# Altium schematic sheet 10.SchDoc
size 246 x 182 mm
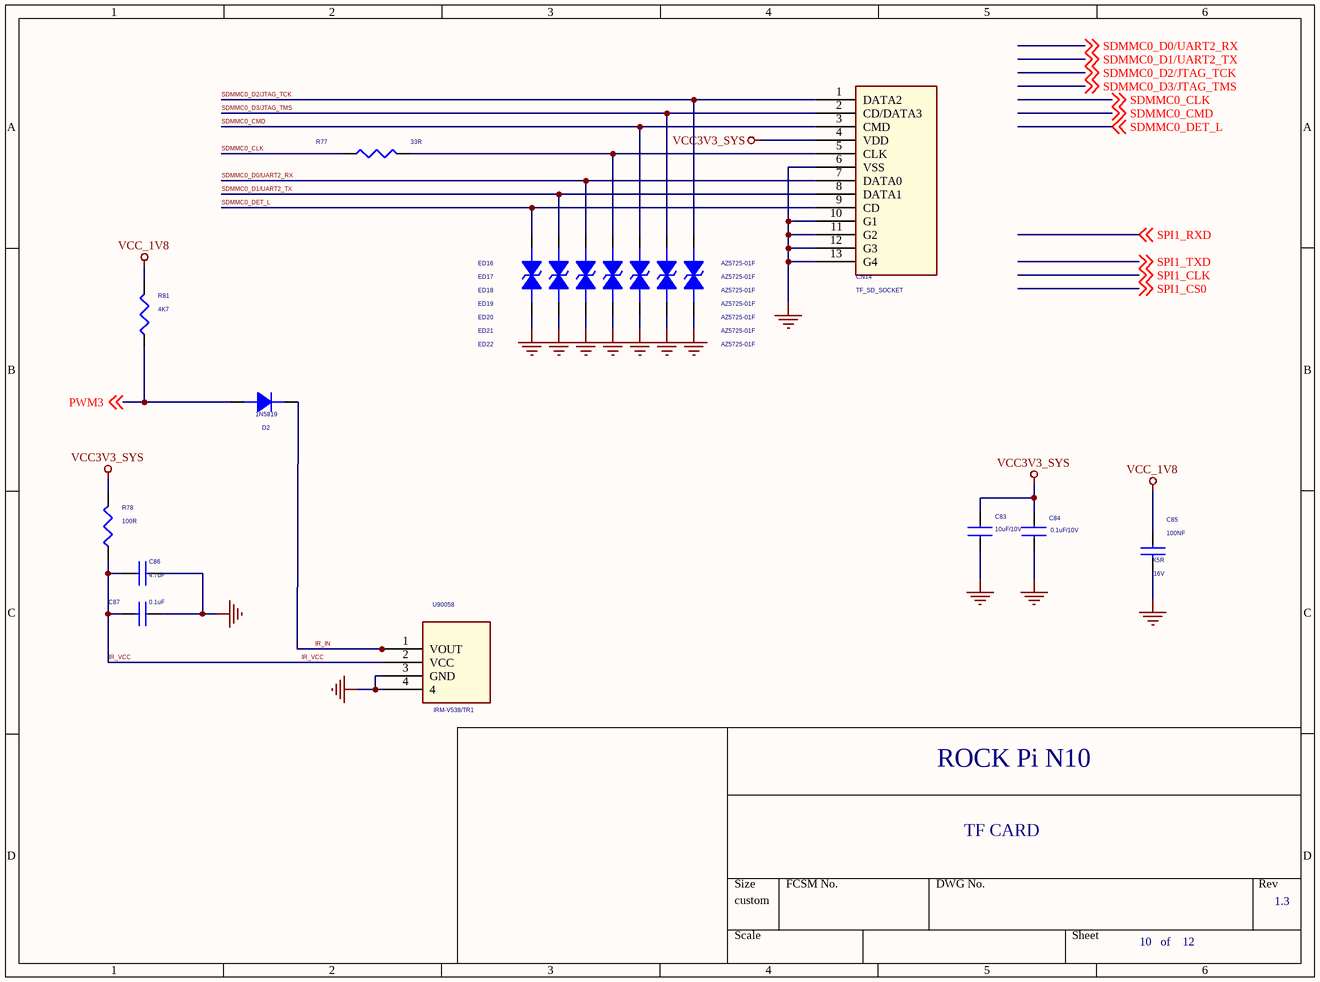
[diagram p0: 10.SchDoc]

## Parts
C83  10uF/10V  [C0603]
C84  0.1uF/10V  [C0603]
C85  100NF  Dielectric: X5R  Voltage: 16V  [C0402]
C86  4.7uF  [C0402]
C87  0.1uF  [C0402]
CN14  TF_SD_SOCKET  [TF-CKT01-009D]
D2  1N5819  [SOD323]
ED16  AZ5725-01F  [E0402N]
ED17  AZ5725-01F  [E0402N]
ED18  AZ5725-01F  [E0402N]
ED19  AZ5725-01F  [E0402N]
ED20  AZ5725-01F  [E0402N]
ED21  AZ5725-01F  [E0402N]
ED22  AZ5725-01F  [E0402N]
R77  33R  [R0402]
R78  100R  [R0402]
R81  4K7  [R0402]
U90058  IRM-V538/TR1  [IRM-V538/TR1]

## Nets
GND: C83.1 C84.2 C85.2 C86.1 C87.1 CN14.6(VSS) CN14.10(G1) CN14.11(G2) CN14.12(G3) CN14.13(G4) ED16.2 ED17.2 ED18.2 ED19.2 ED20.2 ED21.2 ED22.2 U90058.3(GND) U90058.4
VCC3V3_SYS: C83.2 C84.1 CN14.4(VDD) R78.2
VCC_1V8: C85.1 R81.2
IR_IN: D2.2(K) U90058.1(VOUT)
IR_VCC: C86.2 C87.2 R78.1 U90058.2(VCC)
PWM3: D2.1(A) R81.1 ; off-sheet PWM3
SDMMC0_CLK: R77.1 ; off-sheet SDMMC0_CLK
SDMMC0_CMD: CN14.3(CMD) ED20.1 ; off-sheet SDMMC0_CMD
SDMMC0_D0/UART2_RX: CN14.7(DATA0) ED18.1 ; off-sheet SDMMC0_D0/UART2_RX
SDMMC0_D1/UART2_TX: CN14.8(DATA1) ED17.1 ; off-sheet SDMMC0_D1/UART2_TX
SDMMC0_D2/JTAG_TCK: CN14.1(DATA2) ED22.1 ; off-sheet SDMMC0_D2/JTAG_TCK
SDMMC0_D3/JTAG_TMS: CN14.2(CD/DATA3) ED21.1 ; off-sheet SDMMC0_D3/JTAG_TMS
SDMMC0_DET_L: CN14.9(CD) ED16.1 ; off-sheet SDMMC0_DET_L
NetCN14_5: CN14.5(CLK) ED19.1 R77.2

## Notes on the sheet
- ROCK Pi N10
- TF CARD
- 1.3
- 10   of    12

## Library data of the parts
C83 = CAP NP_Dup4: CAP,MLCC,10uF,+/-10%,X5R,6.3V,SMD0805
C84 = CAP NP_Dup4: CAP,MLCC,100nF,+/-10%,X7R,6.3V,SMD0402
C85 = CAP NP_2: cap,100.00nF,+/-10%,16V,X5R,C0402; Manufacturer PN: C1005X5R1C104K050BA; Manufacturer: TDK; Tolerance: 10%; Priority: A; Created by: JJJ; Part Type: C0402; RK PN: C1005X5R1C104K050BA
C86 = CAP NP_Dup1: CAP,MLCC,10uF,+/-10%,X5R,6.3V,SMD0805; Supplier P/N: GRM21BR61C106K; Supplier: MURATA
C87 = CAP NP_4
CN14 = SD_SOCKET_0
D2 = DIODE_Dup1: RoHS 1.0A SURFACE MOUNT SCHOTTKY BARRIER RECTIFIER 1N5819
ED16-ED22 = DIODE BI-DIR TRIG: ESD
R77 = RESISTOR_1
R78 = RESISTOR_Dup1: RES,thick film,10Ohm,+/-5%,1/10W,SMD0603
R81 = RESISTOR_Dup1: RES,thick film,10KOhm,+/-5%,1/16W,SMD0402